# Altium schematic sheet SH03-AD.SchDoc
size A4
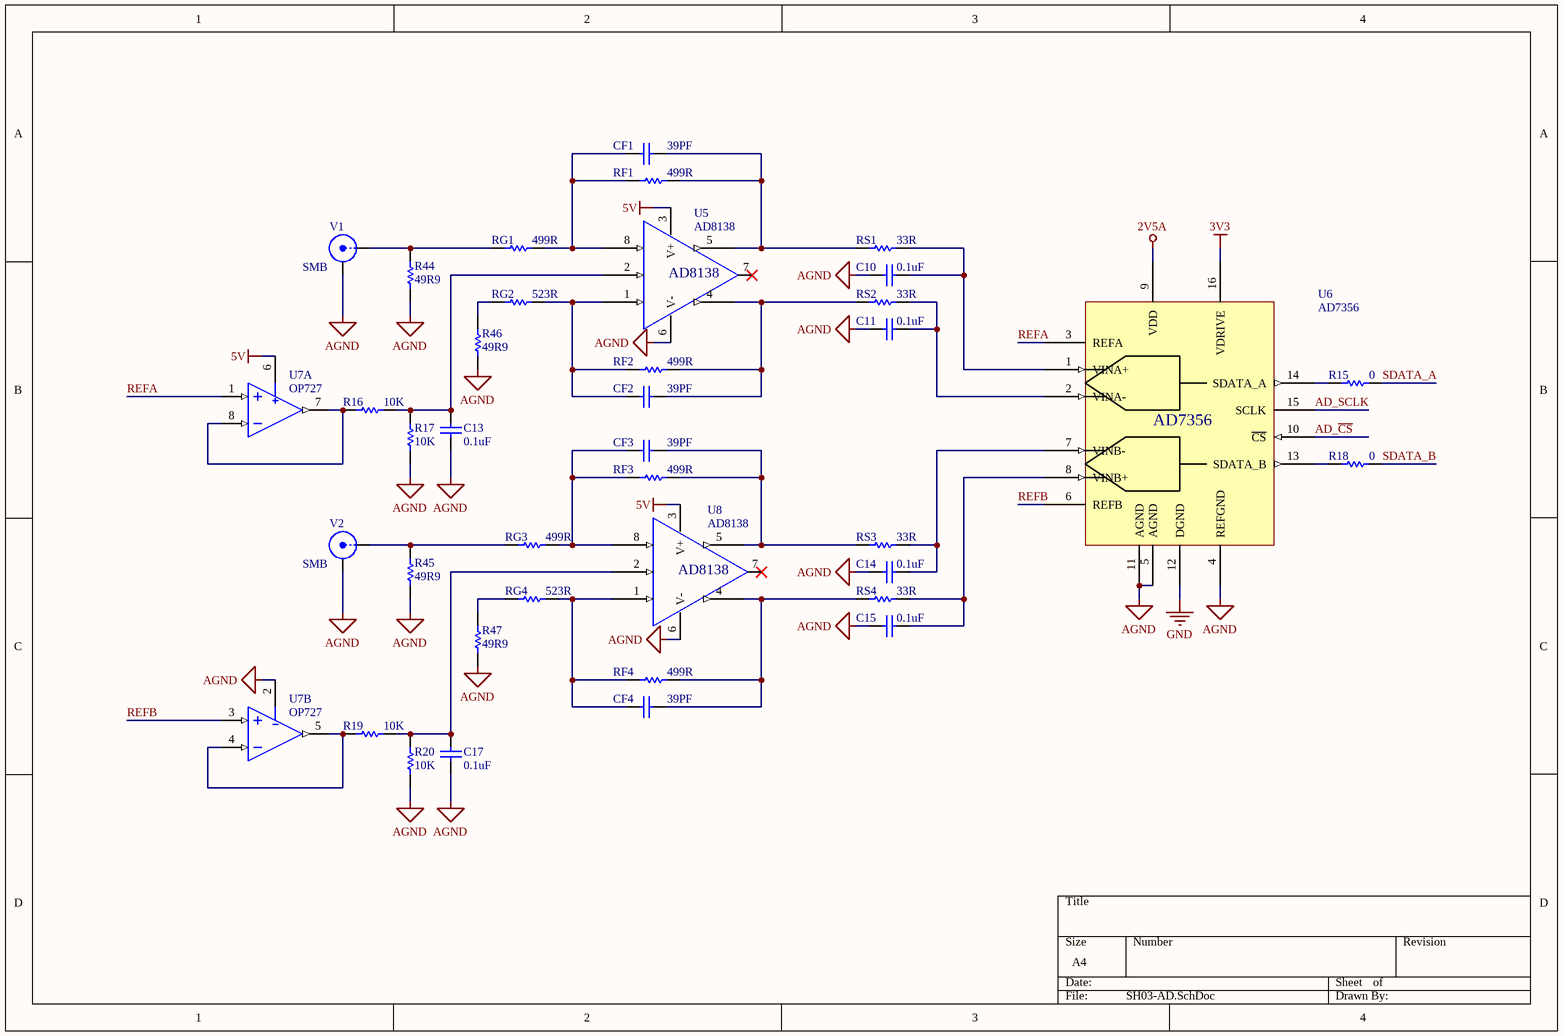
[diagram p0: SH03-AD.SchDoc]

## Parts
C10  value 0.1uF  [1608[0603]]  (hidden comment: Cap,0.1uF/0603)
C11  value 0.1uF  [1608[0603]]  (hidden comment: Cap,0.1uF/0603)
C13  value 0.1uF  [1608[0603]]  (hidden comment: Cap,0.1uF/0603)
C14  value 0.1uF  [1608[0603]]  (hidden comment: Cap,0.1uF/0603)
C15  value 0.1uF  [1608[0603]]  (hidden comment: Cap,0.1uF/0603)
C17  value 0.1uF  [1608[0603]]  (hidden comment: Cap,0.1uF/0603)
CF1  value 39PF  [1608[0603]]  (hidden comment: Cap,39PF/0603)
CF2  value 39PF  [1608[0603]]  (hidden comment: Cap,39PF/0603)
CF3  value 39PF  [1608[0603]]  (hidden comment: Cap,39PF/0603)
CF4  value 39PF  [1608[0603]]  (hidden comment: Cap,39PF/0603)
R15  value 0  [1608[0603]]  (hidden comment: Res,0R/0603)
R16  value 10K  [1608[0603]]  (hidden comment: Res,10K/0603)
R17  value 10K  [1608[0603]]  (hidden comment: Res,10K/0603)
R18  value 0  [1608[0603]]  (hidden comment: Res,0R/0603)
R19  value 10K  [1608[0603]]  (hidden comment: Res,10K/0603)
R20  value 10K  [1608[0603]]  (hidden comment: Res,10K/0603)
R44  value 49R9  [1608[0603]]  (hidden comment: Res,49R9/0603)
R45  value 49R9  [1608[0603]]  (hidden comment: Res,49R9/0603)
R46  value 49R9  [1608[0603]]  (hidden comment: Res,49R9/0603)
R47  value 49R9  [1608[0603]]  (hidden comment: Res,49R9/0603)
RF1  value 499R  [1608[0603]]  (hidden comment: Res,499R/0603)
RF2  value 499R  [1608[0603]]  (hidden comment: Res,499R/0603)
RF3  value 499R  [1608[0603]]  (hidden comment: Res,499R/0603)
RF4  value 499R  [1608[0603]]  (hidden comment: Res,499R/0603)
RG1  value 499R  [1608[0603]]  (hidden comment: Res,499R/0603)
RG2  value 523R  [1608[0603]]  (hidden comment: Res,523R/0603)
RG3  value 499R  [1608[0603]]  (hidden comment: Res,499R/0603)
RG4  value 523R  [1608[0603]]  (hidden comment: Res,523R/0603)
RS1  value 33R  [1608[0603]]  (hidden comment: Res,33R/0603)
RS2  value 33R  [1608[0603]]  (hidden comment: Res,33R/0603)
RS3  value 33R  [1608[0603]]  (hidden comment: Res,33R/0603)
RS4  value 33R  [1608[0603]]  (hidden comment: Res,33R/0603)
U5  AD8138  [SOIC127P600X175-8N]
U6  AD7356  [TSOP65P640X120-16N]
U7  OP727  [SOIC127P600X175-8N]  (parts A,B of 2)
U8  AD8138  [SOIC127P600X175-8N]
V1  SMB  [SMB_V-RJ45]
V2  SMB  [SMB_V-RJ45]

## Nets
2V5A: U6.9(VDD)
3V3: U6.16(VDRIVE)
5V: U5.3(V+) U7.6(V+) U8.3(V+)
AGND: C10.2 C11.2 C13.2 C14.2 C15.2 C17.2 R17.1 R20.1 R44.2 R45.2 R46.2 R47.2 U5.6(V-) U6.4(REFGND) U6.5(AGND) U6.11(AGND) U7.2(V-) U8.6(V-) V1.2(Y) V2.2(Y)
GND: U6.12(DGND)
AD_~{CS}: U6.10(~{CS})
AD_SCLK: U6.15(SCLK)
REFA: U6.3(REFA) U7.1(+INA)
REFB: U6.6(REFB) U7.3(+INB)
SDATA_A: R15.2
SDATA_B: R18.2
NetC10_1: C10.1 RS1.1 U6.1(VINA+)
NetC11_1: C11.1 RS2.1 U6.2(VINA-)
NetC13_1: C13.1 R16.2 R17.2 U5.2(VOCM)
NetC14_1: C14.1 RS3.1 U6.7(VINB-)
NetC15_1: C15.1 RS4.1 U6.8(VINB+)
NetC17_1: C17.1 R19.2 R20.2 U8.2(VOCM)
NetCF1_1: CF1.1 RF1.1 RS1.2 U5.5(-OUT)
NetCF1_2: CF1.2 RF1.2 RG1.1 U5.8(+IN)
NetCF2_1: CF2.1 RF2.1 RS2.2 U5.4(+OUT)
NetCF2_2: CF2.2 RF2.2 RG2.1 U5.1(-IN)
NetCF3_1: CF3.1 RF3.1 RS3.2 U8.5(-OUT)
NetCF3_2: CF3.2 RF3.2 RG3.1 U8.8(+IN)
NetCF4_1: CF4.1 RF4.1 RS4.2 U8.4(+OUT)
NetCF4_2: CF4.2 RF4.2 RG4.1 U8.1(-IN)
NetR15_1: R15.1 U6.14(SDATA_A)
NetR16_1: R16.1 U7.7(OUTA) U7.8(-INA)
NetR18_1: R18.1 U6.13(SDATA_B)
NetR19_1: R19.1 U7.4(-INB) U7.5(OUTB)
NetR44_1: R44.1 RG1.2 V1.1(X)
NetR45_1: R45.1 RG3.2 V2.1(X)
NetR46_1: R46.1 RG2.2
NetR47_1: R47.1 RG4.2

Not connected (* = marked no-connect by the designer): U5 7(NC)*; U8 7(NC)*

## Library data of the parts
C10 C11 C13-C15 C17 CF1-CF4 = Cap: Capacitor; Published: 8-Jun-2000; LatestRevisionDate: 17-Jul-2002; LatestRevisionNote: Re-released for DXP Platform.; PackageReference: RAD-0.3; Publisher: Altium Limited
R15-R20 R44-R47 RF1-RF4 RG1-RG4 RS1-RS4 = Res1: Resistor; Published: 8-Jun-2000; LatestRevisionDate: 17-Jul-2002; LatestRevisionNote: Re-released for DXP Platform.; PackageReference: AXIAL-0.3; Publisher: Altium Limited
U5 U8 = AD8138: Low Distortion  Differential ADC Driver; Note: Pin 2 is analog ground; Published: 8-Jun-2000; LatestRevisionDate: 04-Mar-2005; LatestRevisionNote: Stylized 3D Model Added.; DatasheetVersion: REV.B 1998; PackageVersion: revA; PackageReference: N-8; Publisher: Altium Limited; PackageDescription: DIP; 8 Leads; Row Spacing 7.62 mm; Pitch 2.54 mm; ComponentLink1Description: Manufacturer Link; ComponentLink1URL: http://www.analog.com/en/prod/0%2C2877%2CAD626%2C00.html; ComponentLink2Description: Datasheet; ComponentLink2URL: http://www.analog.com/UploadedFiles/Data_Sheets/441354443AD626_d.pdf
U6 = AD7356: Differential Input, Dual, Simultaneous  Sampling, 5 MSPS, 12-Bit, SAR ADC
U7 = AMP_OP727: Precision Micropower  Single-Supply Operational Amplifiers; Published: 8-Jun-2000; LatestRevisionDate: 17-Jul-2002; LatestRevisionNote: Re-released for DXP Platform.; DatasheetVersion: 1992; PackageVersion: revC, 1990; PackageReference: H-12A; Publisher: Altium Limited; PackageDescription: Can; 12 Leads; 10.16 mm Square Array; Lead Dia. 0.53 mm (max); ComponentLink1Description: Manufacturer Link; ComponentLink1URL: http://www.analog.com/
V1 V2 = SMB: SMB Straight Connector; LatestRevisionDate: 17-Jul-2002; LatestRevisionNote: Re-released for DXP Platform.; Publisher: Altium Limited